# Altium schematic sheet DSP_Block.SchDoc
size A4; SheetNumber: 10; SheetTotal: 15
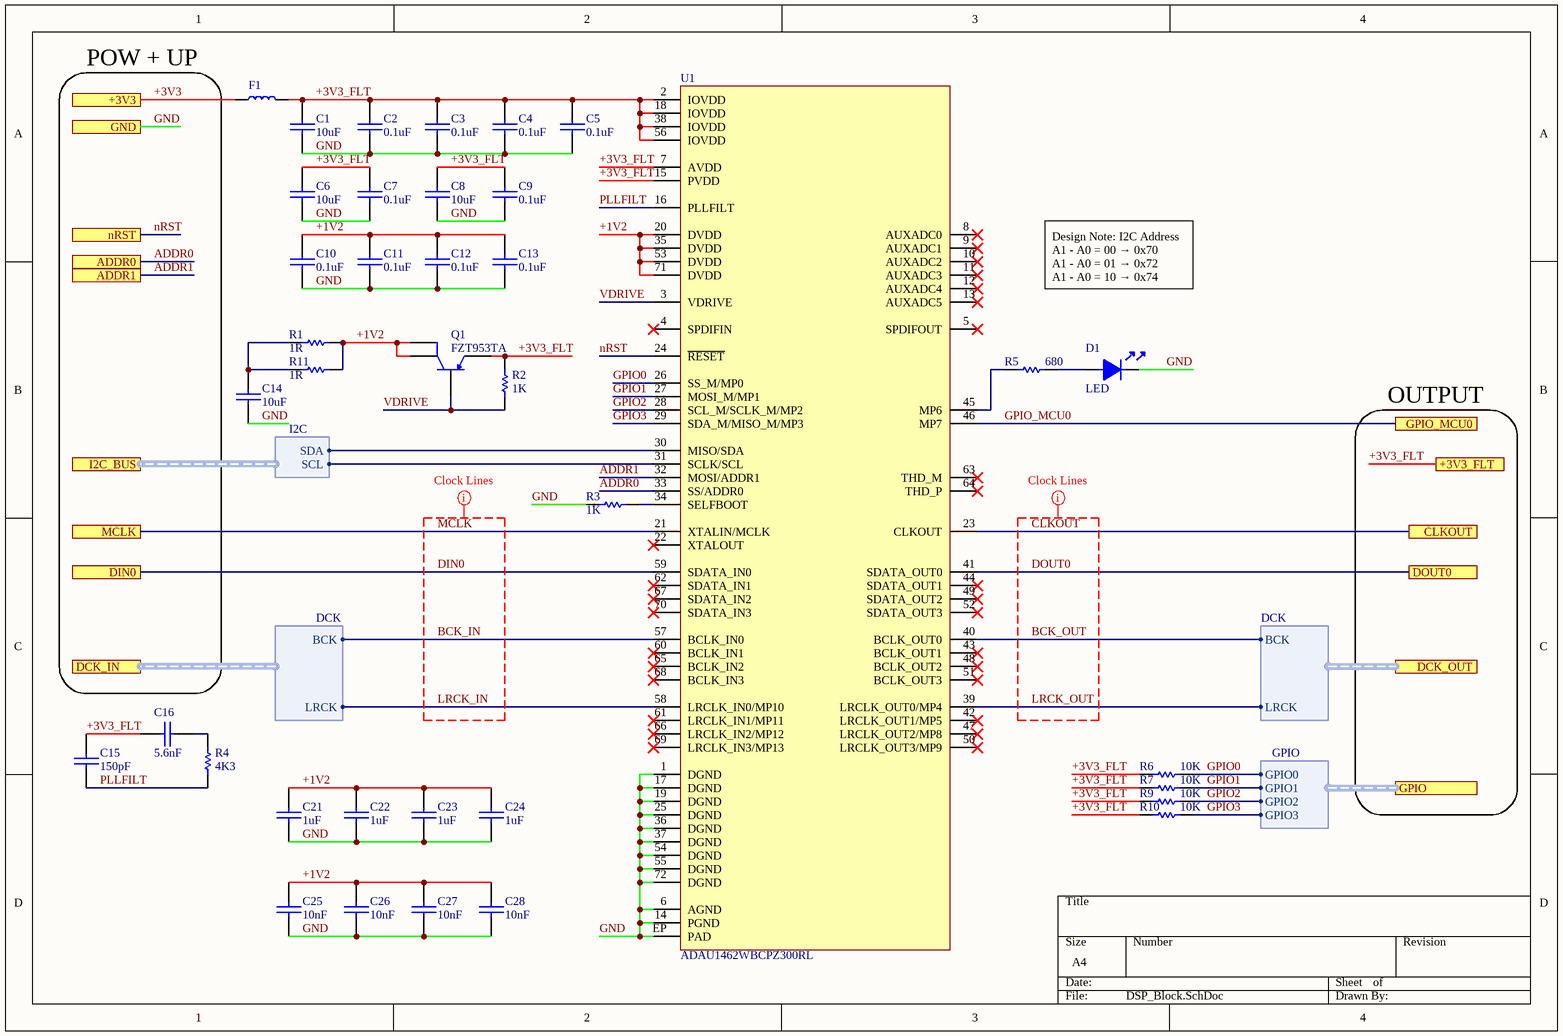
[diagram p0: DSP_Block.SchDoc]

## Parts
C1  10uF  [0402-CAP-TDK]
C2  0.1uF  [0402-CAP-TDK]
C3  0.1uF  [0402-CAP-TDK]
C4  0.1uF  [0402-CAP-TDK]
C5  0.1uF  [0402-CAP-TDK]
C6  10uF  [0402-CAP-TDK]
C7  0.1uF  [0402-CAP-TDK]
C8  10uF  [0402-CAP-TDK]
C9  0.1uF  [0402-CAP-TDK]
C10  0.1uF  [0402-CAP-TDK]
C11  0.1uF  [0402-CAP-TDK]
C12  0.1uF  [0402-CAP-TDK]
C13  0.1uF  [0402-CAP-TDK]
C14  10uF  [0402-CAP-TDK]
C15  150pF  [0402-CAP-TDK]
C16  5.6nF  [0402-CAP-TDK]
C21  1uF  [0402-CAP-TDK]
C22  1uF  [0402-CAP-TDK]
C23  1uF  [0402-CAP-TDK]
C24  1uF  [0402-CAP-TDK]
C25  10nF  [0402-CAP-TDK]
C26  10nF  [0402-CAP-TDK]
C27  10nF  [0402-CAP-TDK]
C28  10nF  [0402-CAP-TDK]
D1  LED  [LED-0805]
F1  BLM18PG181SN1D  [0603-IND-MURATA]  (value not drawn)
Q1  FZT953TA  [SOT223-DN]
R1  1R  [0603-RES-PANASONIC]
R2  1K  [0402-RES-PANASONIC]
R3  1K  [0402-RES-PANASONIC]
R4  4K3  [0402-RES-PANASONIC]
R5  680  [0402-RES-PANASONIC]
R6  10K  [0402-RES-PANASONIC]
R7  10K  [0402-RES-PANASONIC]
R9  10K  [0402-RES-PANASONIC]
R10  10K  [0402-RES-PANASONIC]
R11  1R  [0603-RES-PANASONIC]
U1  ADAU1462WBCPZ300RL  [LFCSP-VQ-72]

## Ports
+3V3, +3V3_FLT, ADDR0, ADDR1, CLKOUT, DCK_IN (harness DCK), DCK_OUT (harness DCK), DIN0, DOUT0, GND, GPIO (harness GPIO), GPIO_MCU0, I2C_BUS (harness I2C), MCLK, nRST

## Harnesses
I2C: SCL, SDA
DCK: BCK, LRCK
GPIO: GPIO0, GPIO1, GPIO2, GPIO3

## Nets
+1V2: C10.2 C11.2 C12.2 C13.2 C21.2 C22.2 C23.2 C24.2 C25.2 C26.2 C27.2 C28.2 Q1.C Q1.C-TAB R1.1 R11.1 U1.20(DVDD) U1.35(DVDD) U1.53(DVDD) U1.71(DVDD)
+3V3: F1.2 ; port +3V3
+3V3_FLT: C1.2 C2.2 C3.2 C4.2 C5.2 C6.2 C7.2 C8.2 C9.2 C15.2 C16.2 F1.1 Q1.E R2.2 R6.1 R7.2 R9.1 R10.2 U1.2(IOVDD) U1.7(AVDD) U1.15(PVDD) U1.18(IOVDD) U1.38(IOVDD) U1.56(IOVDD) ; port +3V3_FLT
ADDR0: U1.33(SS/ADDR0) ; port ADDR0
ADDR1: U1.32(MOSI/ADDR1) ; port ADDR1
BCK_IN: U1.57(BCLK_IN0) ; port DCK_IN.BCK
BCK_OUT: U1.40(BCLK_OUT0) ; port DCK_OUT.BCK
CLKOUT: U1.23(CLKOUT) ; port CLKOUT
DIN0: U1.59(SDATA_IN0) ; port DIN0
DOUT0: U1.41(SDATA_OUT0) ; port DOUT0
GND: C1.1 C2.1 C3.1 C4.1 C5.1 C6.1 C7.1 C8.1 C9.1 C10.1 C11.1 C12.1 C13.1 C14.1 C21.1 C22.1 C23.1 C24.1 C25.1 C26.1 C27.1 C28.1 D1.2 R3.2 U1.1(DGND) U1.6(AGND) U1.14(PGND) U1.17(DGND) U1.19(DGND) U1.25(DGND) U1.36(DGND) U1.37(DGND) U1.54(DGND) U1.55(DGND) U1.72(DGND) U1.EP(PAD) ; port GND
GPIO0: R6.2 U1.26(SS_M/MP0) ; port GPIO.GPIO0
GPIO1: R7.1 U1.27(MOSI_M/MP1) ; port GPIO.GPIO1
GPIO2: R9.2 U1.28(SCL_M/SCLK_M/MP2) ; port GPIO.GPIO2
GPIO3: R10.1 U1.29(SDA_M/MISO_M/MP3) ; port GPIO.GPIO3
GPIO_MCU0: U1.46(MP7) ; port GPIO_MCU0
LRCK_IN: U1.58(LRCLK_IN0/MP10) ; port DCK_IN.LRCK
LRCK_OUT: U1.39(LRCLK_OUT0/MP4) ; port DCK_OUT.LRCK
MCLK: U1.21(XTALIN/MCLK) ; port MCLK
nRST: U1.24(~{RESET}) ; port nRST
PLLFILT: C15.1 R4.1 U1.16(PLLFILT)
VDRIVE: Q1.B R2.1 U1.3(VDRIVE)
NetC14_2: C14.2 R1.2 R11.2
NetC16_1: C16.1 R4.2
NetD1_1: D1.1 R5.2
NetR3_1: R3.1 U1.34(SELFBOOT)
NetR5_1: R5.1 U1.45(MP6)
NetU1_30: U1.30(MISO/SDA) ; port I2C_BUS.SDA
NetU1_31: U1.31(SCLK/SCL) ; port I2C_BUS.SCL

Not connected (* = marked no-connect by the designer): U1 4(SPDIFIN)* 5(SPDIFOUT)* 8(AUXADC0)* 9(AUXADC1)* 10(AUXADC2)* 11(AUXADC3)* 12(AUXADC4)* 13(AUXADC5)* 22(XTALOUT)* 42(LRCLK_OUT1/MP5)* 43(BCLK_OUT1)* 44(SDATA_OUT1)* 47(LRCLK_OUT2/MP8)* 48(BCLK_OUT2)* 49(SDATA_OUT2)* 50(LRCLK_OUT3/MP9)* 51(BCLK_OUT3)* 52(SDATA_OUT3)* 60(BCLK_IN1)* 61(LRCLK_IN1/MP11)* 62(SDATA_IN1)* 63(THD_M)* 64(THD_P)* 65(BCLK_IN2)* 66(LRCLK_IN2/MP12)* 67(SDATA_IN2)* 68(BCLK_IN3)* 69(LRCLK_IN3/MP13)* 70(SDATA_IN3)*

## Layout directives
net class CLK: BCK_IN, BCK_OUT, CLKOUT, DIN0, DOUT0, LRCK_IN, LRCK_OUT, MCLK

## Notes on the sheet
- POW + UP
- Design Note: I2C Address
  A1 - A0 = 00 → 0x70
  A1 - A0 = 01 → 0x72
  A1 - A0 = 10 → 0x74
- OUTPUT

## Library data of the parts
C1-C16 C21-C28 = CAP-SMD
  C1 C6 C8 C14: JLCPart: C324476
  C2-C5 C7 C9-C13: JLCPart: C307331
  C15: JLCPart: C237333
  C16: JLCPart: C513725
  C21-C24: JLCPart: C52923
  C25-C28: JLCPart: C15195
D1 = LED-SMD: JLCPart: C84256
F1 = BLM18PG181SN1D: 90mΩ ±25% 180Ω@100MHz 1.5A - 0603; JLCPart: C82850; Digikey_PN: 490-5263-1-ND
Q1 = FZT953TA: Bipolar (BJT) Transistor PNP 100 V 5 A 120MHz 3 W Surface Mount SOT-223-3; Digikey_PN: FZT953CT-ND; JLCPart: C110507
R1-R7 R9-R11 = RES-SMD
  R1 R11: JLCPart: C22936
  R2 R3: JLCPart: C11702
  R4: JLCPart: C477725
  R5: JLCPart: C25130
  R6 R7 R9 R10: JLCPart: C25744
U1 = ADAU1462WBCPZ300RL: SigmaDSP 294.912 MHz, 32-bit Audio Processor; JLCPart: C654408